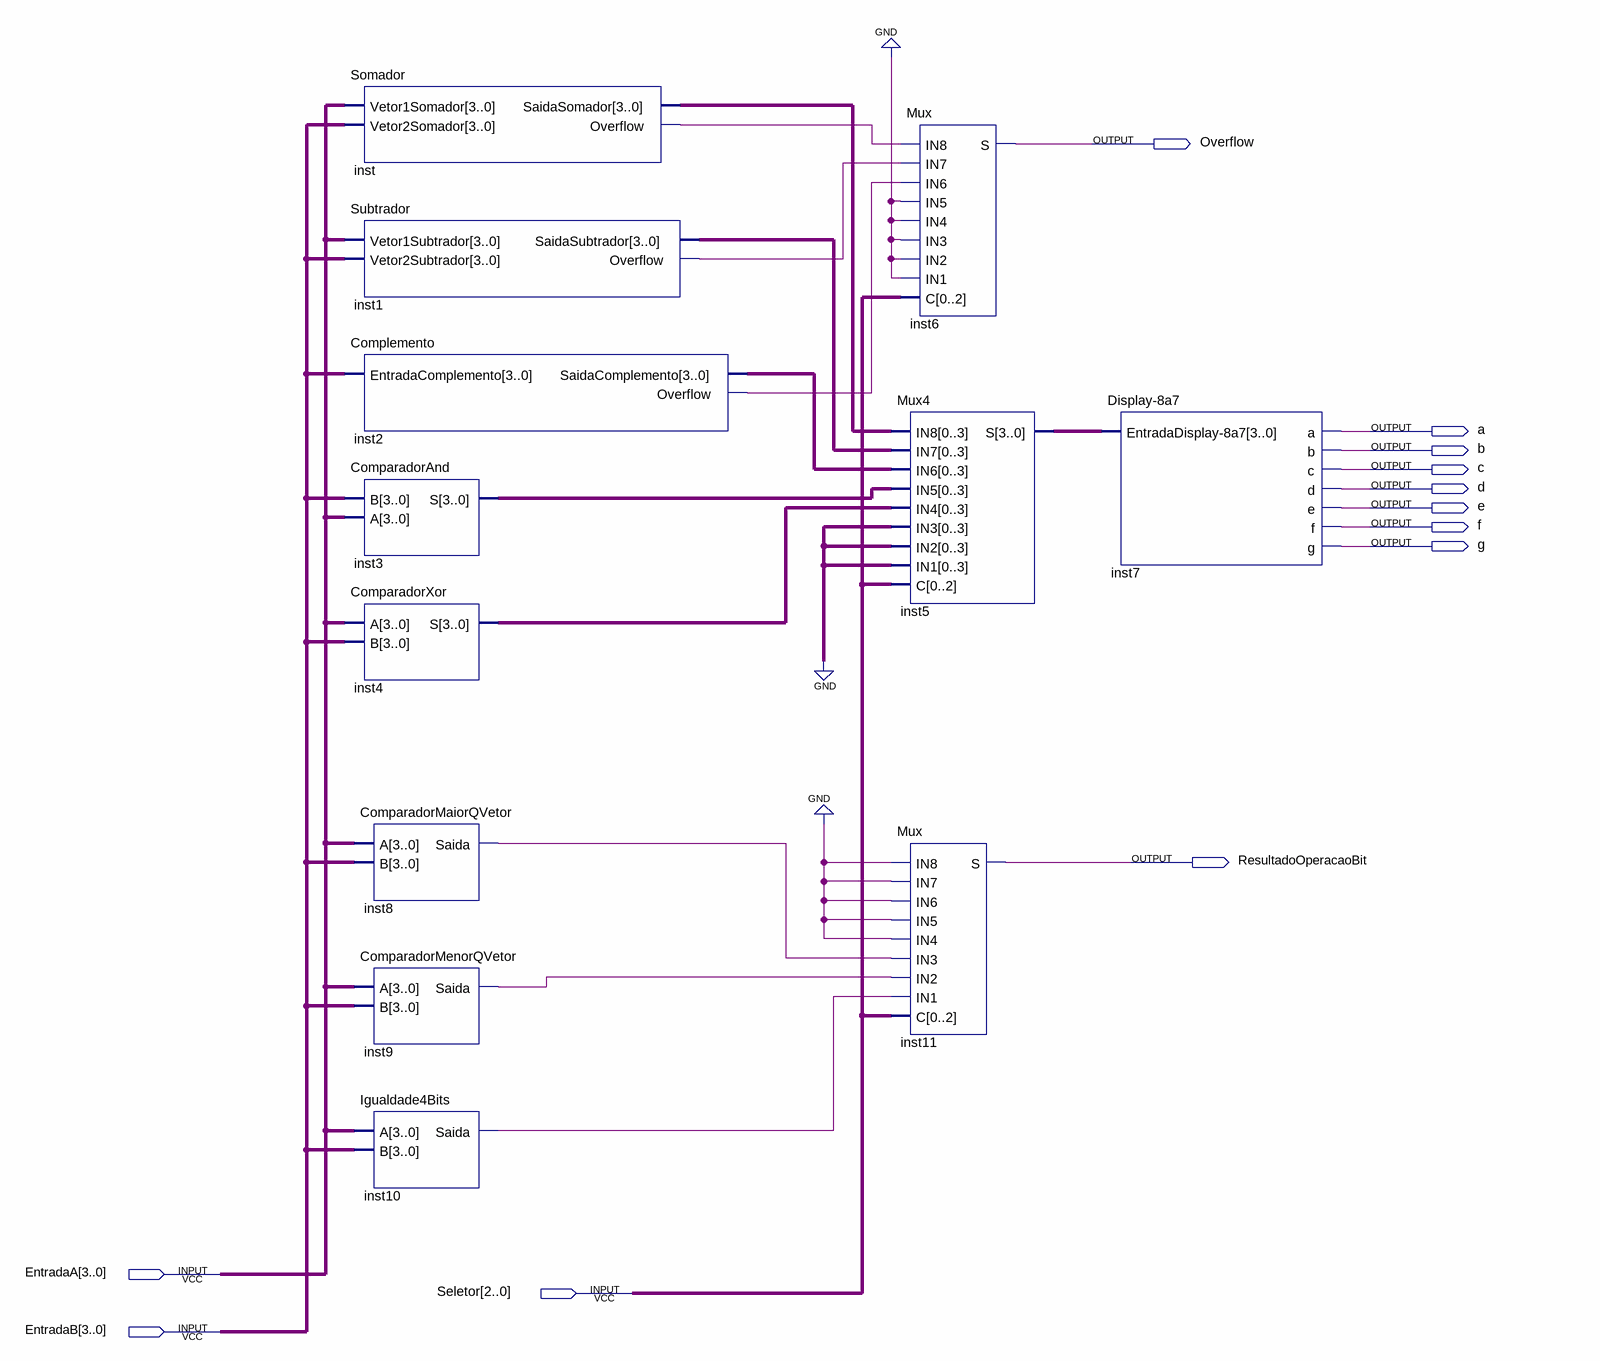
[diagram p0: schematic sheet]
// Quartus schematic ULA.bdf as structural Verilog: 12 symbols, 12 pins
module ULA (
  input  [3:0] EntradaA,
  input  [2:0] Seletor,
  input  [3:0] EntradaB,
  output Overflow,
  output a,
  output b,
  output c,
  output d,
  output e,
  output f,
  output g,
  output ResultadoOperacaoBit
);

  wire inst1_overflow, inst2_overflow, inst8_saida, inst9_saida, inst10_saida, inst_overflow;
  wire [3:0] inst1_saidasubtrador, inst2_saidacomplemento, inst3_s, inst4_s, inst5_s, inst_saidasomador;

  Somador inst (
    .Vetor1Somador(EntradaA), .Vetor2Somador(EntradaB), .SaidaSomador(inst_saidasomador),
    .Overflow(inst_overflow));
  Subtrador inst1 (
    .Vetor1Subtrador(EntradaA), .Vetor2Subtrador(EntradaB), .SaidaSubtrador(inst1_saidasubtrador),
    .Overflow(inst1_overflow));
  Complemento inst2 (
    .EntradaComplemento(EntradaB), .SaidaComplemento(inst2_saidacomplemento), .Overflow(inst2_overflow));
  ComparadorAnd inst3 (.B(EntradaB), .A(EntradaA), .S(inst3_s));
  ComparadorXor inst4 (.A(EntradaA), .B(EntradaB), .S(inst4_s));
  ComparadorMaiorQVetor inst8 (.A(EntradaA), .B(EntradaB), .Saida(inst8_saida));
  ComparadorMenorQVetor inst9 (.A(EntradaA), .B(EntradaB), .Saida(inst9_saida));
  Igualdade4Bits inst10 (.A(EntradaA), .B(EntradaB), .Saida(inst10_saida));
  Mux inst6 (
    .IN8(inst_overflow), .IN7(inst1_overflow), .IN6(inst2_overflow), .IN5(1'b0), .IN4(1'b0), .IN3(1'b0),
    .IN2(1'b0), .IN1(1'b0), .C(Seletor), .S(Overflow));
  Mux4 inst5 (
    .IN8(inst_saidasomador), .IN7(inst1_saidasubtrador), .IN6(inst2_saidacomplemento), .IN5(inst3_s),
    .IN4(inst4_s), .IN3(4'b0000), .IN2(4'b0000), .IN1(4'b0000), .C(Seletor), .S(inst5_s));
  Mux inst11 (
    .IN8(1'b0), .IN7(1'b0), .IN6(1'b0), .IN5(1'b0), .IN4(1'b0), .IN3(inst8_saida), .IN2(inst9_saida),
    .IN1(inst10_saida), .C(Seletor), .S(ResultadoOperacaoBit));
  \Display-8a7  inst7 (.\EntradaDisplay-8a7 (inst5_s), .a(a), .b(b), .c(c), .d(d), .e(e), .f(f), .g(g));
endmodule
